# Altium schematic sheet sheet2.SchDoc
size A; DocumentNumber: 19; SheetNumber: 15; SheetTotal: 19
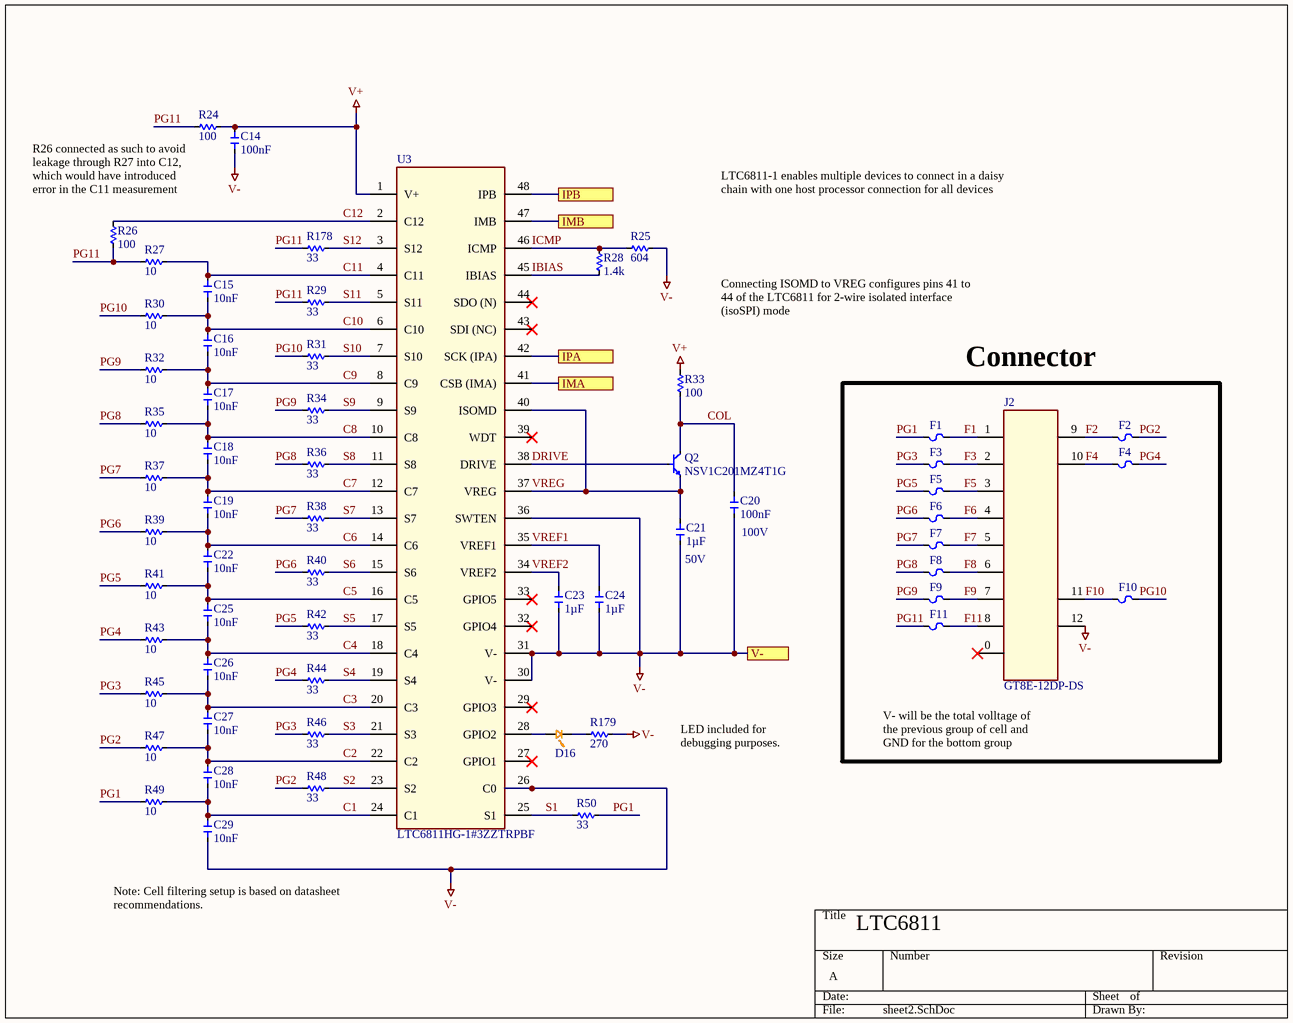
[diagram p0: sheet2.SchDoc]

## Parts
C14  value 100nF  [C0603_0.80MM]  (hidden comment: CGJ3E3X7S2A104K080AA)
C15  value 10nF  [C0603_0.90MM]  (hidden comment: CGA3E2C0G1H103J080AA)
C16  value 10nF  [C0603_0.90MM]  (hidden comment: CGA3E2C0G1H103J080AA)
C17  value 10nF  [C0603_0.90MM]  (hidden comment: CGA3E2C0G1H103J080AA)
C18  value 10nF  [C0603_0.90MM]  (hidden comment: CGA3E2C0G1H103J080AA)
C19  value 10nF  [C0603_0.90MM]  (hidden comment: CGA3E2C0G1H103J080AA)
C20  value 100nF  Voltage - Rated: 100V  [C0603_0.80MM]  (hidden comment: CGJ3E3X7S2A104K080AA)
C21  value 1µF  Voltage - Rated: 50V  [C0805_1.45MM]  (hidden comment: CGA4J3X5R1H105K125AB)
C22  value 10nF  [C0603_0.90MM]  (hidden comment: CGA3E2C0G1H103J080AA)
C23  value 1µF  [C0805_1.45MM]  (hidden comment: CGA4J3X5R1H105K125AB)
C24  value 1µF  [C0805_1.45MM]  (hidden comment: CGA4J3X5R1H105K125AB)
C25  value 10nF  [C0603_0.90MM]  (hidden comment: CGA3E2C0G1H103J080AA)
C26  value 10nF  [C0603_0.90MM]  (hidden comment: CGA3E2C0G1H103J080AA)
C27  value 10nF  [C0603_0.90MM]  (hidden comment: CGA3E2C0G1H103J080AA)
C28  value 10nF  [C0603_0.90MM]  (hidden comment: CGA3E2C0G1H103J080AA)
C29  value 10nF  [C0603_0.90MM]  (hidden comment: CGA3E2C0G1H103J080AA)
D16  LTST-C194KFKT  [LED_0603P_ORANGE]  (value not drawn)
F1  C2Q 250  [R0603_0.50MM]  (value not drawn)
F2  C2Q 250  [R0603_0.50MM]  (value not drawn)
F3  C2Q 250  [R0603_0.50MM]  (value not drawn)
F4  C2Q 250  [R0603_0.50MM]  (value not drawn)
F5  C2Q 250  [R0603_0.50MM]  (value not drawn)
F6  C2Q 250  [R0603_0.50MM]  (value not drawn)
F7  C2Q 250  [R0603_0.50MM]  (value not drawn)
F8  C2Q 250  [R0603_0.50MM]  (value not drawn)
F9  C2Q 250  [R0603_0.50MM]  (value not drawn)
F10  C2Q 250  [R0603_0.50MM]  (value not drawn)
F11  C2Q 250  [R0603_0.50MM]  (value not drawn)
J2  GT8E-12DP-DS  [GT8E-12DP-DS]
Q2  NSV1C201MZ4T1G  [NPN]
R24  value 100  [R0805_0.70MM]  (hidden comment: ERJ-P06F1000V)
R25  value 604  [R0603_0.55MM]  (hidden comment: ERJ-3EKF6040V)
R26  value 100  [R0603_0.55MM]  (hidden comment: ERJ-3EKF1000V)
R27  value 10  [R0603_0.55MM]  (hidden comment: ERJ-PA3F10R0V)
R28  value 1.4k  [R0603_0.55MM]  (hidden comment: ERJ-3EKF1401V)
R29  value 33  [R0603_0.55MM]  (hidden comment: ERJ-PA3F33R0V)
R30  value 10  [R0603_0.55MM]  (hidden comment: ERJ-PA3F10R0V)
R31  value 33  [R0603_0.55MM]  (hidden comment: ERJ-PA3F33R0V)
R32  value 10  [R0603_0.55MM]  (hidden comment: ERJ-PA3F10R0V)
R33  value 100  [R0603_0.55MM]  (hidden comment: ERJ-PA3F1000V)
R34  value 33  [R0603_0.55MM]  (hidden comment: ERJ-PA3F33R0V)
R35  value 10  [R0603_0.55MM]  (hidden comment: ERJ-PA3F10R0V)
R36  value 33  [R0603_0.55MM]  (hidden comment: ERJ-PA3F33R0V)
R37  value 10  [R0603_0.55MM]  (hidden comment: ERJ-PA3F10R0V)
R38  value 33  [R0603_0.55MM]  (hidden comment: ERJ-PA3F33R0V)
R39  value 10  [R0603_0.55MM]  (hidden comment: ERJ-PA3F10R0V)
R40  value 33  [R0603_0.55MM]  (hidden comment: ERJ-PA3F33R0V)
R41  value 10  [R0603_0.55MM]  (hidden comment: ERJ-PA3F10R0V)
R42  value 33  [R0603_0.55MM]  (hidden comment: ERJ-PA3F33R0V)
R43  value 10  [R0603_0.55MM]  (hidden comment: ERJ-PA3F10R0V)
R44  value 33  [R0603_0.55MM]  (hidden comment: ERJ-PA3F33R0V)
R45  value 10  [R0603_0.55MM]  (hidden comment: ERJ-PA3F10R0V)
R46  value 33  [R0603_0.55MM]  (hidden comment: ERJ-PA3F33R0V)
R47  value 10  [R0603_0.55MM]  (hidden comment: ERJ-PA3F10R0V)
R48  value 33  [R0603_0.55MM]  (hidden comment: ERJ-PA3F33R0V)
R49  value 10  [R0603_0.55MM]  (hidden comment: ERJ-PA3F10R0V)
R50  value 33  [R0603_0.55MM]  (hidden comment: ERJ-PA3F33R0V)
R178  value 33  [R0603_0.55MM]  (hidden comment: ERJ-PA3F33R0V)
R179  value 270  [R0603_0.55MM]  (hidden comment: ERJ-PA3F2700V)
U3  LTC6811HG-1#3ZZTRPBF  [48TSSOP50]

## Ports
IMA, IMB, IPA, IPB, V-

## Nets
V+: C14.1 R24.2 R33.1 U3.1(V+)
V-: C14.2 C20.2 C21.2 C23.2 C24.2 C29.1 J2.12 R25.2 R179.2 U3.26(C0) U3.30(V-) U3.31(V-) U3.36(SWTEN) ; port V-
C1: C28.1 C29.2 R49.2 U3.24(C1)
C2: C27.1 C28.2 R47.2 U3.22(C2)
C3: C26.1 C27.2 R45.2 U3.20(C3)
C4: C25.1 C26.2 R43.2 U3.18(C4)
C5: C22.1 C25.2 R41.2 U3.16(C5)
C6: C19.1 C22.2 R39.2 U3.14(C6)
C7: C18.1 C19.2 R37.2 U3.12(C7)
C8: C17.1 C18.2 R35.2 U3.10(C8)
C9: C16.1 C17.2 R32.2 U3.8(C9)
C10: C15.1 C16.2 R30.2 U3.6(C10)
C11: C15.2 R27.2 U3.4(C11)
C12: R26.2 U3.2(C12)
COL: C20.1 Q2.2 R33.2
DRIVE: Q2.1 U3.38(DRIVE)
F1: F1.2 J2.1
F2: F2.1 J2.9
F3: F3.2 J2.2
F4: F4.1 J2.10
F5: F5.2 J2.3
F6: F6.2 J2.4
F7: F7.2 J2.5
F8: F8.2 J2.6
F9: F9.2 J2.7
F10: F10.1 J2.11
F11: F11.2 J2.8
IBIAS: R28.2 U3.45(IBIAS)
ICMP: R25.1 R28.1 U3.46(ICMP)
IMA: U3.41(CSB_(IMA)) ; port IMA
IMB: U3.47(IMB) ; port IMB
IPA: U3.42(SCK_(IPA)) ; port IPA
IPB: U3.48(IPB) ; port IPB
PG1: F1.1 R49.1 R50.2
PG2: F2.2 R47.1 R48.1
PG3: F3.1 R45.1 R46.1
PG4: F4.2 R43.1 R44.1
PG5: F5.1 R41.1 R42.1
PG6: F6.1 R39.1 R40.1
PG7: F7.1 R37.1 R38.1
PG8: F8.1 R35.1 R36.1
PG9: F9.1 R32.1 R34.1
PG10: F10.2 R30.1 R31.1
PG11: F11.1 R24.1 R26.1 R27.1 R29.1 R178.1
S1: R50.1 U3.25(S1)
S2: R48.2 U3.23(S2)
S3: R46.2 U3.21(S3)
S4: R44.2 U3.19(S4)
S5: R42.2 U3.17(S5)
S6: R40.2 U3.15(S6)
S7: R38.2 U3.13(S7)
S8: R36.2 U3.11(S8)
S9: R34.2 U3.9(S9)
S10: R31.2 U3.7(S10)
S11: R29.2 U3.5(S11)
S12: R178.2 U3.3(S12)
VREF1: C24.1 U3.35(VREF1)
VREF2: C23.1 U3.34(VREF2)
VREG: C21.1 Q2.3 U3.37(VREG) U3.40(ISOMD)
NetD16_1: D16.1 R179.1
NetD16_2: D16.2 U3.28(GPIO2)

Not connected (* = marked no-connect by the designer): J2 0*; U3 27(GPIO1)* 29(GPIO3)* 32(GPIO4)* 33(GPIO5)* 39(WDT)* 43(SDI_(NC))* 44(SDO_(N))*

## Notes on the sheet
- (near R24) R26 connected as such to avoid leakage through R27 into C12, which would have introduced error in the C11 measurement
- LTC6811-1 enables multiple devices to connect in a daisy chain with one host processor connection for all devices
- Connecting ISOMD to VREG configures pins 41 to 44 of the LTC6811 for 2-wire isolated interface (isoSPI) mode
- Connector
- LED included for debugging purposes.
- V- will be the total volltage of the previous group of cell and GND for the bottom group
- (near C29) Note: Cell filtering setup is based on datasheet recommendations.
- LTC6811

## Library data of the parts
C14 C20 = CMP-019-0364-1: CAP CER 0.1UF 100V X7S 0603; Manufacturer: TDK Corporation; Unit Price (USD): 0.39; Tolerance: 10%; ComponentLink1URL: https://product.tdk.com/info/en/catalog/datasheets/mlcc_highreliability_midvoltage_en.pdf?ref_disty=digikey; Size / Dimension: 0.063" L x 0.031" W (1.60mm x 0.80mm); Case/Package: 0603 (1608 Metric); ComponentLink1Description: Series Datasheet; Operating Temperature: -55°C ~ 125°C; Mounting Type: Surface Mount, MLCC; Part Status: Active; Thickness (Max): 0.031" (0.80mm); Manufacturer Part Number: CGJ3E3X7S2A104K080AA; Series: CGJ; Digi-Key Part Number: 445-9154-1-ND; Temperature Coefficient: X7S; Applications: AEC-Q200
  C14: Voltage - Rated: 100V
C15-C19 C22 C25-C29 = CMP-019-0544-1: CAP CER 10000PF 50V C0G 0603; Manufacturer: TDK Corporation; Unit Price (USD): 0.3; Tolerance: 5%; Temperature Coefficient: C0G, NP0; Mounting Type: Surface Mount, MLCC; ComponentLink1URL: https://product.tdk.com/info/en/catalog/datasheets/mlcc_automotive_general_en.pdf?ref_disty=digikey; Size / Dimension: 0.063" L x 0.031" W (1.60mm x 0.80mm); Digi-Key Part Number: 445-6916-1-ND; Part Status: Active; Series: CGA; Manufacturer Part Number: CGA3E2C0G1H103J080AA; Thickness (Max): 0.035" (0.90mm); Operating Temperature: -55°C ~ 125°C; ComponentLink1Description: Series Datasheet; Voltage - Rated: 50V; Applications: AEC-Q200; Case/Package: 0603 (1608 Metric)
C21 C23 C24 = CMP-019-0890-1: CAP CER 1UF 50V X5R 0805; Manufacturer: TDK Corporation; Tolerance: 10%; Unit Price (USD): 0.48; Operating Temperature: -55°C ~ 85°C; ComponentLink1Description: Series Datasheet; Size / Dimension: 0.079" L x 0.049" W (2.00mm x 1.25mm); Digi-Key Part Number: 445-12703-1-ND; Thickness (Max): 0.057" (1.45mm); Manufacturer Part Number: CGA4J3X5R1H105K125AB; ComponentLink1URL: https://product.tdk.com/info/en/catalog/datasheets/mlcc_automotive_general_en.pdf?ref_disty=digikey; Mounting Type: Surface Mount, MLCC; Series: CGA; Part Status: Active; Case/Package: 0805 (2012 Metric); Temperature Coefficient: X5R; Applications: AEC-Q200
  C23 C24: Voltage - Rated: 50V
D16 = CMP-007-00000-1: LED ORANGE CLEAR SMD; Dominant Wavelength: 605nm; Number of LEDs: 1; Forward Current: 5mA; Power Rating: 75mW; Lens Style: Diffused,Colorless,Rectangular; Lens Color: Colorless; Viewing Angle: 130°; Luminous Intensity: 162.5mcd; Test Current: 20mA; Forward Voltage: 2V; Min Operating Temperature: -30°C; Width: 0.8mm; Case/Package: 0603; Mount: Surface Mount; Illumination Color: Orange; Case Code (Metric): 1608; Length: 1.6mm; Height: 0.35mm; Max Operating Temperature: 85°C; Color: Orange; Number of Pins: 2; Package Quantity: 1; Radiation Hardening: No; Lens Transparency: Clear; Case Code (Imperial): 0603; Packaging: Tape and Reel
F1-F11 = C2Q 250: FUSE BOARD MNT 250MA 32VAC 63VDC; Manufacturer: Bel Fuse Inc.; Type: Board Mount (Cartridge Style Excluded); Voltage Rating - AC: 32V; Voltage Rating - DC: 63V; Response Time: Fast Blow; Breaking Capacity @ Rated Voltage: 35A AC, 50A DC; Melting I²t: 0.002; Approval Agency: CE, cURus; Manufacturer Part Number: C2Q 250; ComponentLink1URL: https://belfuse.com/resources/datasheets/circuitprotection/ds-cp-c2q-series.pdf; ComponentLink1Description: Datasheet; Current Rating: 250mA; Digi-Key Part Number: 507-1086-1-ND; Part Status: Active; Other: -; Operating Temperature: -55°C ~ 125°C; Package / Case: 0603 (1608 Metric); Mounting Type: Surface Mount; Height (Max): 0.019" (0.48mm); Size / Dimension: 0.063" L x 0.032" W x 0.019" H (1.60mm x 0.82mm x 0.48mm)
J2 = GT8E-12DP-DS: CONN HEADER R/A 12POS 2MM; Manufacturer: Hirose Electric Co Ltd; Connector Type: Header, Shrouded; Number of Positions: 12; Pitch: 0.079" (2.00mm); Gender: Female; Supplier 1: Mouser; RoHS: RoHS Compliant; Category: Automotive Connectors; Stock 1: 160; Pricing 1: 1=4.32, 10=4.14, 25=3.62, 100=3.46, 250=3.02, 500=2.93, 1000=2.50, 2500=2.32, 5000=2.24 (AUD); ComponentLink1URL: https://www.mouser.com/datasheet/2/185/GT8E_catalog-939506.pdf; ComponentLink1Description: Datasheet; Supplier Part Number 1: 798-GT8E-12DP-DS; Color: Black; Contact Finish: Tin; Contact Type: Male Pin; Fastening Type: Latch Lock; Features: Board Guide; Mounting Type: Through Hole, Right Angle; Number of Rows: 2; Termination: Solder; Manufacturer Part Number: GT8E-12DP-DS; Digi-Key Part Number: H122078-ND; Part Status: Active; Operating Temperature: -; Height (Max): 0.39" (10mm); Size / Dimension: 0.882" L x 0.585" W (22.4mm x 14.85mm); Rated Voltage: -; Current Rating: -
Q2 = CMP-039-0000-1: TRANS NPN 100V 2A SOT223-4; Manufacturer: ON Semiconductor; Frequency - Transition: 100MHz; Current - Collector Cutoff (Max): 100nA (ICBO); Power - Max: 800mW; DC Current Gain (hFE) (Min) @ Ic, Vce: 120 @ 500mA, 2V; Vce Saturation (Max) @ Ib, Ic: 180mV @ 200mA, 2A; Case/Package: TO-261-4, TO-261AA; Part Status: Active; ComponentLink1Description: Datasheet; Digi-Key Part Number: NSV1C201MZ4T1GOSCT-ND; Mounting Type: Surface Mount; Operating Temperature: -55°C ~ 150°C (TJ); Current - Collector (Ic) (Max): 2A; Supplier Device Package: SOT-223 (TO-261); Manufacturer Part Number: NSV1C201MZ4T1G; Height (Max): 1.65mm; Size / Dimension: 6.5mm L x 3.5mm W; Transistor Type: NPN; Voltage - Collector Emitter Breakdown (Max): 100V; ComponentLink1URL: http://www.onsemi.com/pub/Collateral/NSS1C201MZ4-D.PDF
R24 = CMP-038-1390-1: RES SMD 100 OHM 1% 1/2W 0805; Manufacturer: Panasonic Electronic Components; Unit Price (USD): 0.17; Temperature Coefficient: ±100ppm/°C; Power (Watts): 0.5W, 1/2W; Tolerance: 1%; Operating Temperature: -55°C ~ 155°C; Series: ERJ; ComponentLink1Description: Datasheet; Height - Seated (Max): 0.028" (0.70mm); Supplier Device Package: 0805; Manufacturer Part Number: ERJ-P06F1000V; Composition: Thick Film; Features: Automotive AEC-Q200, Pulse Withstanding; Case/Package: 0805 (2012 Metric); Size / Dimension: 0.079" L x 0.049" W (2.00mm x 1.25mm); Digi-Key Part Number: P16057CT-ND; ComponentLink1URL: https://industrial.panasonic.com/cdbs/www-data/pdf/RDO0000/AOA0000C331.pdf
R25 = CMP-038-2035-1: RES SMD 604 OHM 1% 1/10W 0603; Manufacturer: Panasonic Electronic Components; Unit Price (USD): 0.1; Power (Watts): 0.1W, 1/10W; Temperature Coefficient: ±100ppm/°C; Features: Automotive AEC-Q200; ComponentLink1URL: https://industrial.panasonic.com/cdbs/www-data/pdf/RDA0000/AOA0000C304.pdf; Case/Package: 0603 (1608 Metric); Series: ERJ; ComponentLink1Description: Datasheet; Digi-Key Part Number: P604HCT-ND; Operating Temperature: -55°C ~ 155°C; Tolerance: 1%; Composition: Thick Film; Manufacturer Part Number: ERJ-3EKF6040V; Height - Seated (Max): 0.022" (0.55mm); Size / Dimension: 0.063" L x 0.031" W (1.60mm x 0.80mm); Supplier Device Package: 0603
R26 = CMP-038-1387-1: RES SMD 100 OHM 1% 1/10W 0603; Manufacturer: Panasonic Electronic Components; Unit Price (USD): 0.1; Power (Watts): 0.1W, 1/10W; Temperature Coefficient: ±100ppm/°C; Manufacturer Part Number: ERJ-3EKF1000V; ComponentLink1Description: Datasheet; ComponentLink1URL: https://industrial.panasonic.com/cdbs/www-data/pdf/RDA0000/AOA0000C304.pdf; Digi-Key Part Number: P100HCT-ND; Series: ERJ; Tolerance: 1%; Composition: Thick Film; Features: Automotive AEC-Q200; Operating Temperature: -55°C ~ 155°C; Supplier Device Package: 0603; Size / Dimension: 0.063" L x 0.031" W (1.60mm x 0.80mm); Height - Seated (Max): 0.022" (0.55mm); Case/Package: 0603 (1608 Metric)
R27 R30 R32 R35 R37 R39 R41 R43 R45 R47 R49 = CMP-038-0571-1: RES SMD 10 OHM 1% 1/4W 0603; Manufacturer: Panasonic Electronic Components; Power (Watts): 0.25W, 1/4W; Temperature Coefficient: ±100ppm/°C; Unit Price (USD): 0.14; Features: Automotive AEC-Q200, Pulse Withstanding; Operating Temperature: -55°C ~ 155°C; Supplier Device Package: 0603; Case/Package: 0603 (1608 Metric); Composition: Thick Film; ComponentLink1Description: Datasheet; Height - Seated (Max): 0.022" (0.55mm); Tolerance: 1%; ComponentLink1URL: https://industrial.panasonic.com/cdbs/www-data/pdf/RDO0000/AOA0000C331.pdf; Digi-Key Part Number: P10.00BYCT-ND; Size / Dimension: 0.063" L x 0.031" W (1.60mm x 0.80mm); Manufacturer Part Number: ERJ-PA3F10R0V; Series: ERJ
R28 = CMP-038-2336-1: RES SMD 1.4K OHM 1% 1/10W 0603; Manufacturer: Panasonic Electronic Components; Unit Price (USD): 0.1; Power (Watts): 0.1W, 1/10W; Temperature Coefficient: ±100ppm/°C; Operating Temperature: -55°C ~ 155°C; ComponentLink1URL: https://industrial.panasonic.com/cdbs/www-data/pdf/RDA0000/AOA0000C304.pdf; Features: Automotive AEC-Q200; Height - Seated (Max): 0.022" (0.55mm); Case/Package: 0603 (1608 Metric); Tolerance: 1%; Manufacturer Part Number: ERJ-3EKF1401V; Size / Dimension: 0.063" L x 0.031" W (1.60mm x 0.80mm); Digi-Key Part Number: P1.40KHCT-ND; Supplier Device Package: 0603; ComponentLink1Description: Datasheet; Composition: Thick Film; Series: ERJ
R29 R31 R34 R36 R38 R40 R42 R44 R46 R48 R50 R178 = CMP-038-0980-1: RES SMD 33 OHM 1% 1/4W 0603; Manufacturer: Panasonic Electronic Components; Temperature Coefficient: ±100ppm/°C; Power (Watts): 0.25W, 1/4W; Unit Price (USD): 0.14; Features: Automotive AEC-Q200, Pulse Withstanding; ComponentLink1URL: https://industrial.panasonic.com/cdbs/www-data/pdf/RDO0000/AOA0000C331.pdf; Height - Seated (Max): 0.022" (0.55mm); Manufacturer Part Number: ERJ-PA3F33R0V; Series: ERJ; Supplier Device Package: 0603; Size / Dimension: 0.063" L x 0.031" W (1.60mm x 0.80mm); Tolerance: 1%; Operating Temperature: -55°C ~ 155°C; Digi-Key Part Number: P33.00BYCT-ND; ComponentLink1Description: Datasheet; Composition: Thick Film; Case/Package: 0603 (1608 Metric)
R33 = CMP-038-1389-1: RES SMD 100 OHM 1% 1/4W 0603; Manufacturer: Panasonic Electronic Components; Temperature Coefficient: ±100ppm/°C; Power (Watts): 0.25W, 1/4W; Unit Price (USD): 0.14; Size / Dimension: 0.063" L x 0.031" W (1.60mm x 0.80mm); Manufacturer Part Number: ERJ-PA3F1000V; Tolerance: 1%; Features: Automotive AEC-Q200, Pulse Withstanding; ComponentLink1URL: https://industrial.panasonic.com/cdbs/www-data/pdf/RDO0000/AOA0000C331.pdf; ComponentLink1Description: Datasheet; Operating Temperature: -55°C ~ 155°C; Height - Seated (Max): 0.022" (0.55mm); Series: ERJ; Case/Package: 0603 (1608 Metric); Composition: Thick Film; Supplier Device Package: 0603; Digi-Key Part Number: P100BYCT-ND
R179 = CMP-038-1734-1: RES SMD 270 OHM 1% 1/4W 0603; Manufacturer: Panasonic Electronic Components; Unit Price (USD): 0.14; Temperature Coefficient: ±100ppm/°C; Power (Watts): 0.25W, 1/4W; Case/Package: 0603 (1608 Metric); Size / Dimension: 0.063" L x 0.031" W (1.60mm x 0.80mm); Features: Automotive AEC-Q200, Pulse Withstanding; Tolerance: 1%; Digi-Key Part Number: P270BYCT-ND; Manufacturer Part Number: ERJ-PA3F2700V; Series: ERJ; ComponentLink1URL: https://industrial.panasonic.com/cdbs/www-data/pdf/RDO0000/AOA0000C331.pdf; Operating Temperature: -55°C ~ 155°C; Height - Seated (Max): 0.022" (0.55mm); Composition: Thick Film; Supplier Device Package: 0603; ComponentLink1Description: Datasheet
U3 = CMP-029-0000-3: MULTICELL BAT MON S; Manufacturer: Linear Technology/Analog Devices; Protection: Over/Under Voltage; Interface: I²C, SPI; Other: Number of cells: 1 ~ 12; Battery Chemistry: Multi-Chemistry; Output Type: -; Supply Current: -; Output Current: -; Mounting Type: Surface Mount; Case/Package: 48-FSOP (0.209", 5.30mm Width); Digi-Key Part Number: LTC6811HG-1#3ZZTRPBFCT-ND; Size / Dimension: 0.47" L x 0.24" W (12mm x 6mm); Operating Temperature: -40°C ~ 125°C; ComponentLink1Description: Datasheet; Supply Voltage: -; Topology: -; ComponentLink1URL: http://www.linear.com/docs/43171; Height (Max): 0.043" (1.1mm); Frequency: -; Part Status: Active; Manufacturer Part Number: LTC6811HG-1#3ZZTRPBF; Output Voltage: -; Number of Outputs: -; Type: Battery Monitor